# Altium project REX 9628 Extern Kernel 8.PrjPcb
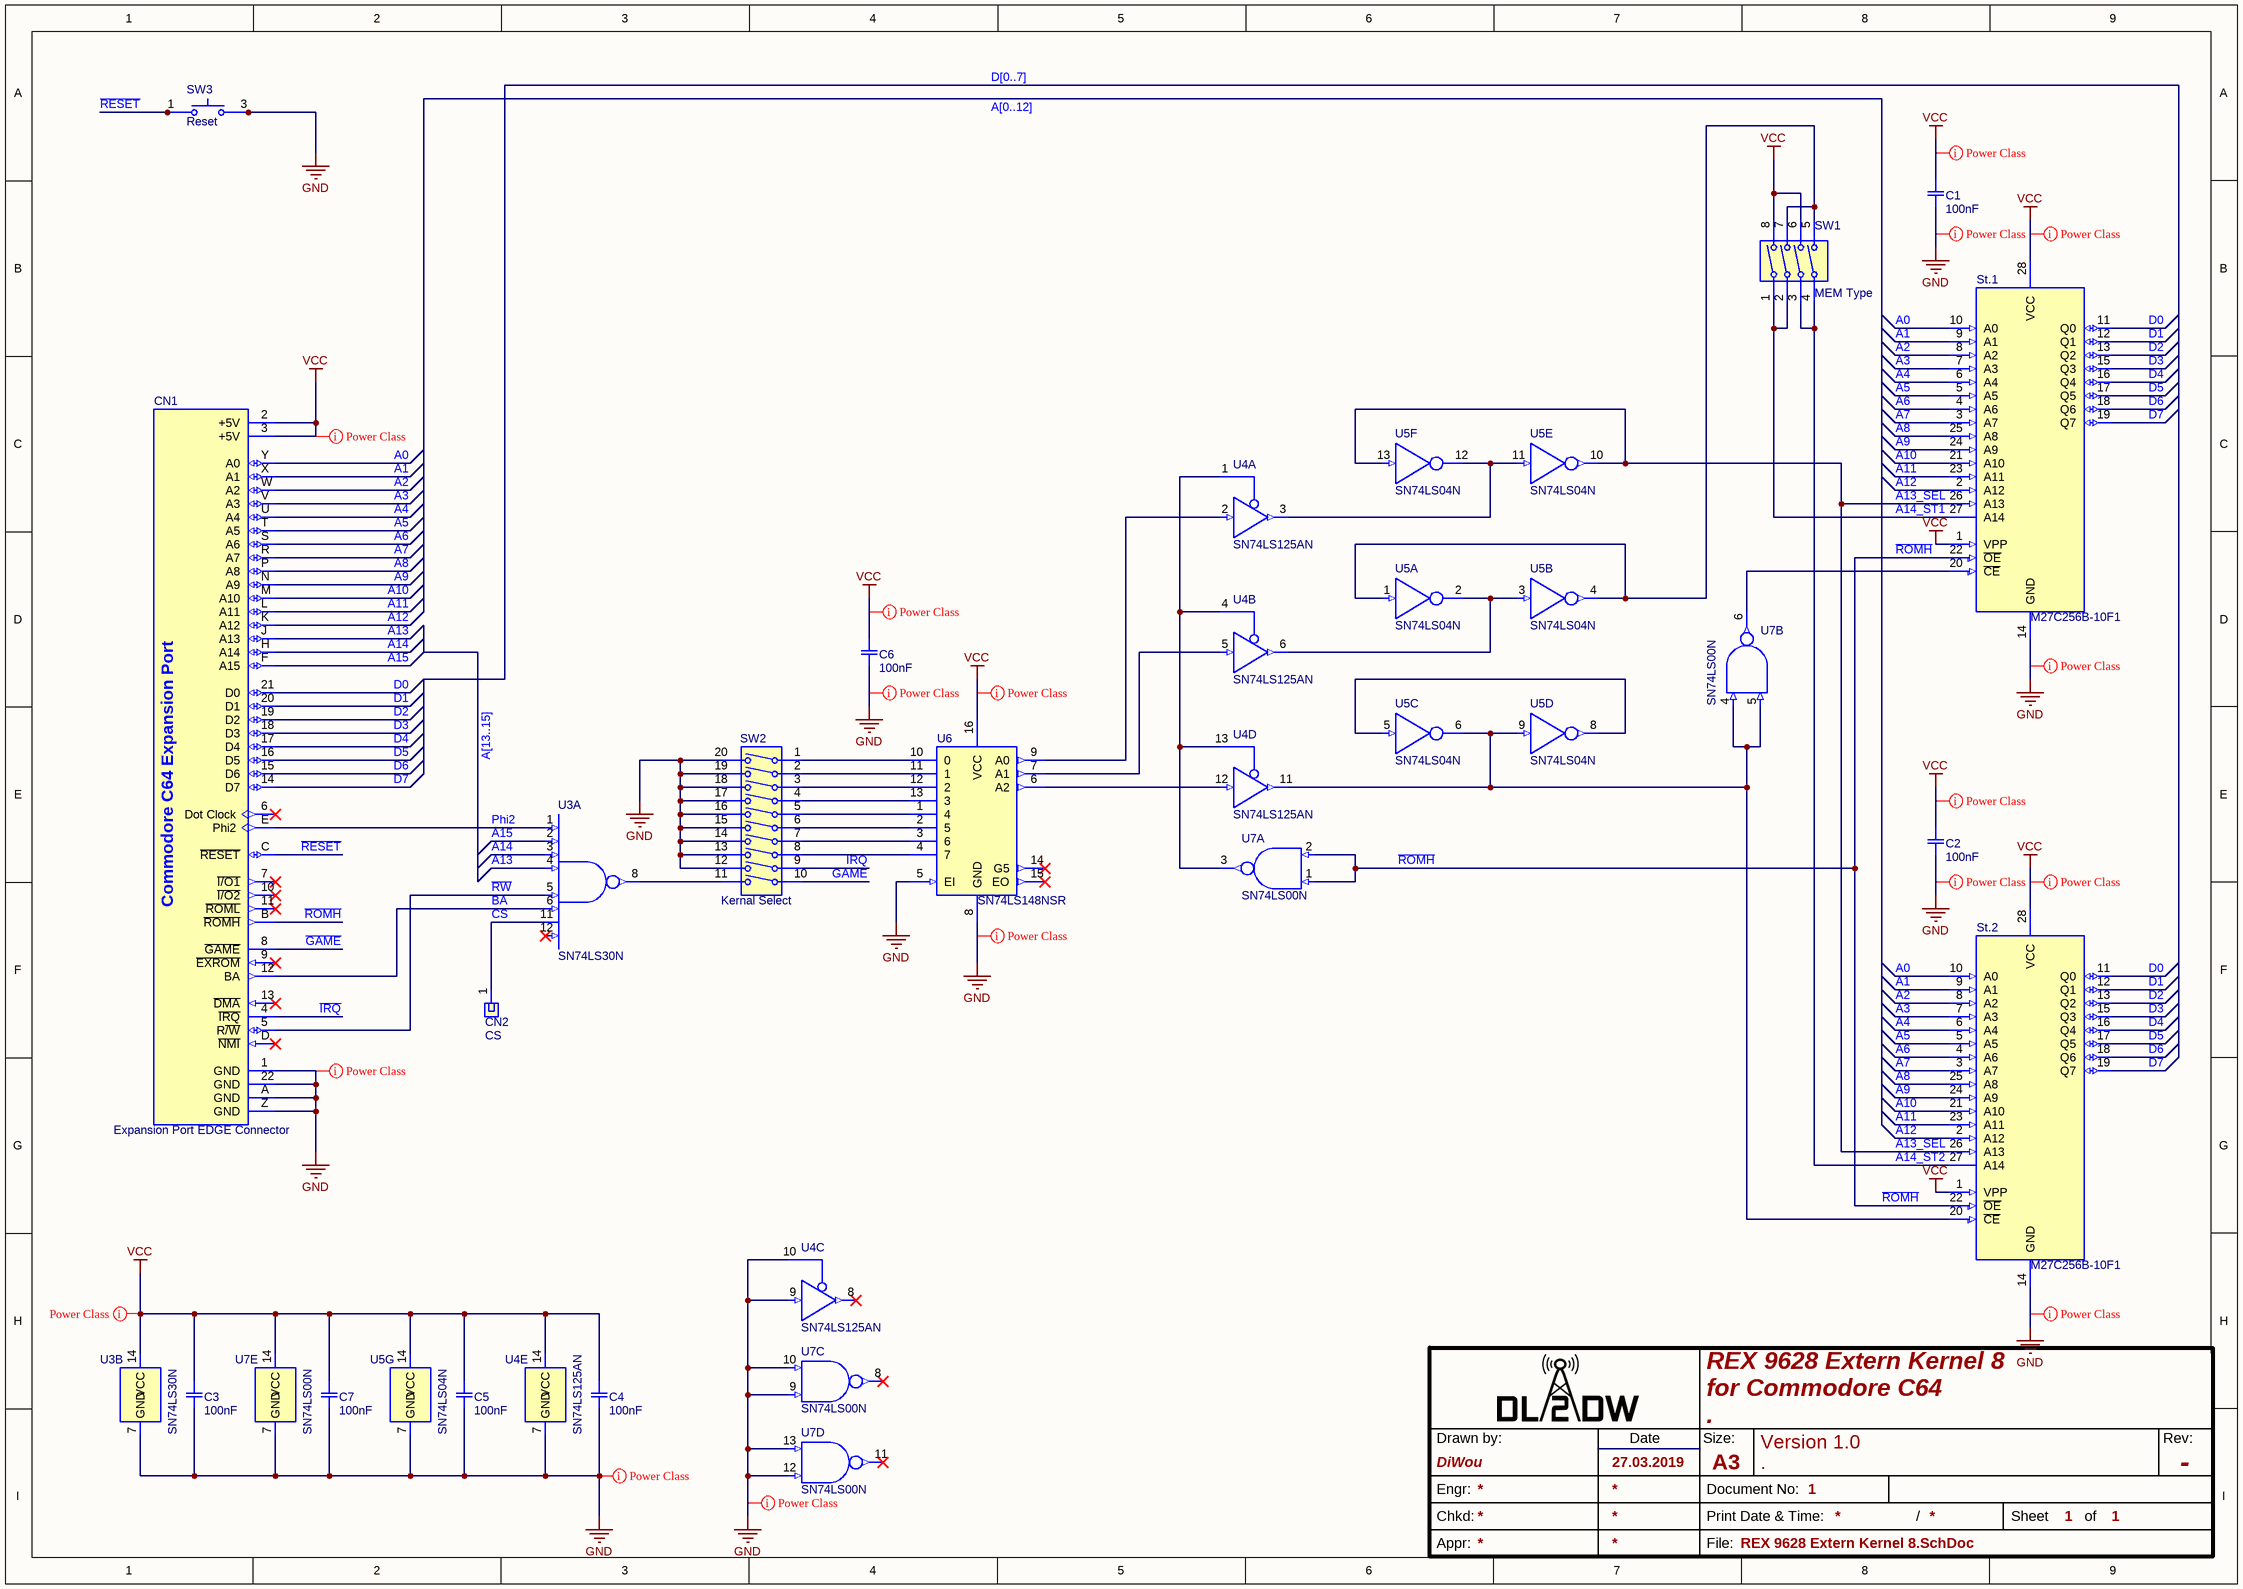
[diagram p0: REX 9628 Extern Kernel 8.SchDoc]
1 sheet, 19 parts. Net scope: global (net labels, ports and power ports of the same name join across sheets).
Board file: REX 9628 Extern Kernel 8.PcbDoc

## Sheet REX 9628 Extern Kernel 8.SchDoc: REX 9628 Extern Kernel 8
size 420 x 297 mm; CompanyName: DL2DW; DrawnBy: DiWou; Organization: DL2DW; DocumentNumber: 1; Revision: -; SheetNumber: 1; SheetTotal: 1; DrawnDate: 27.03.2019; Title1: REX 9628 Extern Kernel 8; Title2: for Commodore C64; Title3: .; Desc1: Version 1.0; Desc2: .

### Parts
C1  100nF  [CAP Disc 100nF P2.54mm D5.5mm T3mm]
C2  100nF  [CAP Disc 100nF P2.54mm D5.5mm T3mm]
C3  100nF  [CAP Disc 100nF P2.54mm D5.5mm T3mm]
C4  100nF  [CAP Disc 100nF P2.54mm D5.5mm T3mm]
C5  100nF  [CAP Disc 100nF P2.54mm D5.5mm T3mm]
C6  100nF  [CAP Disc 100nF P2.54mm D5.5mm T3mm]
C7  100nF  [CAP Disc 100nF P2.54mm D5.5mm T3mm]
CN1  Expansion Port EDGE Connector  [C64 Expansion Port EDGE Connector]  (no BOM)
CN2  CS  [Pin Header 01x01 2.54mm Horizontal Male]
St.1  M27C256B-10F1  [DIP-28 W15.24mm EPROM with Socket]
St.2  M27C256B-10F1  [DIP-28 W15.24mm EPROM with Socket]
SW1  MEM Type  [DIP Switch x04]
SW2  Kernal Select  [DIP Switch x10]
SW3  Reset  [Push Button 12x12mm H8.50mm THT]
U3  SN74LS30N  [SN74LS30N with Socket]  (parts A,B of 2)
U4  SN74LS125AN  [SN74LS125AN with Socket]  (parts A,B,C,D,E of 5)
U5  SN74LS04N  [SN74LS04N with Socket]  (parts A,B,C,D,E,F,G of 7)
U6  SN74LS148NSR  [SN74LS148N with Socket]
U7  SN74LS00N  [SN74LS00N]  (parts A,B,C,D,E of 5)

### Nets
GND: C1.2 C2.2 C3.2 C4.2 C5.2 C6.2 C7.2 CN1.1(GND) CN1.22(GND) CN1.A(GND) CN1.Z(GND) St.1.14(GND) St.2.14(GND) SW2.12 SW2.13 SW2.14 SW2.15 SW2.16 SW2.17 SW2.18 SW2.19 SW2.20 SW3.3 SW3.4 U3.7(GND) U4.7(GND) U4.9(3A) U4.10(~{3G}) U5.7(GND) U6.5(EI) U6.8(GND) U7.7(GND) U7.9(3B) U7.10(3A) U7.12(4B) U7.13(4A)
VCC: C1.1 C2.1 C3.1 C4.1 C5.1 C6.1 C7.1 CN1.2(+5V) CN1.3(+5V) St.1.1(VPP) St.1.28(VCC) St.2.1(VPP) St.2.28(VCC) SW1.6 SW1.8 U3.14(VCC) U4.14(VCC) U5.14(VCC) U6.16(VCC) U7.14(VCC)
~{GAME}: CN1.8(~{GAME}) SW2.10
~{IRQ}: CN1.4(~{IRQ}) SW2.9
~{RESET}: CN1.C(~{RESET}) SW3.1 SW3.2
~{ROMH}: CN1.B(~{ROMH}) St.1.22(~{OE}) St.2.22(~{OE}) U7.1(1A) U7.2(1B)
A0: CN1.Y(A0) St.1.10(A0) St.2.10(A0)
A1: CN1.X(A1) St.1.9(A1) St.2.9(A1)
A2: CN1.W(A2) St.1.8(A2) St.2.8(A2)
A3: CN1.V(A3) St.1.7(A3) St.2.7(A3)
A4: CN1.U(A4) St.1.6(A4) St.2.6(A4)
A5: CN1.T(A5) St.1.5(A5) St.2.5(A5)
A6: CN1.S(A6) St.1.4(A6) St.2.4(A6)
A7: CN1.R(A7) St.1.3(A7) St.2.3(A7)
A8: CN1.P(A8) St.1.25(A8) St.2.25(A8)
A9: CN1.N(A9) St.1.24(A9) St.2.24(A9)
A10: CN1.M(A10) St.1.21(A10) St.2.21(A10)
A11: CN1.L(A11) St.1.23(A11) St.2.23(A11)
A12: CN1.K(A12) St.1.2(A12) St.2.2(A12)
A13: CN1.J(A13) U3.4(D)
A13_SEL: St.1.26(A13) St.2.26(A13) U5.10(5Y) U5.13(6A)
A14: CN1.H(A14) U3.3(C)
A14_ST1: St.1.27(A14) SW1.1 SW1.2
A14_ST2: St.2.27(A14) SW1.3 SW1.4
A15: CN1.F(A15) U3.2(B)
BA: CN1.12(BA) U3.6(F)
CS: CN2.1 U3.11(F)
D0: CN1.21(D0) St.1.11(Q0) St.2.11(Q0)
D1: CN1.20(D1) St.1.12(Q1) St.2.12(Q1)
D2: CN1.19(D2) St.1.13(Q2) St.2.13(Q2)
D3: CN1.18(D3) St.1.15(Q3) St.2.15(Q3)
D4: CN1.17(D4) St.1.16(Q4) St.2.16(Q4)
D5: CN1.16(D5) St.1.17(Q5) St.2.17(Q5)
D6: CN1.15(D6) St.1.18(Q6) St.2.18(Q6)
D7: CN1.14(D7) St.1.19(Q7) St.2.19(Q7)
Phi2: CN1.E(Phi2) U3.1(A)
~{RW}: CN1.5(R~{/W}) U3.5(E)
NetSt.1_20: St.1.20(~{CE}) U7.6(2Y)
NetSt.2_20: St.2.20(~{CE}) U4.11(4Y) U5.6(3Y) U5.9(4A) U7.4(2A) U7.5(2B)
NetSW1_5: SW1.5 SW1.7 U5.1(1A) U5.4(2Y)
NetSW2_1: SW2.1 U6.10(0)
NetSW2_2: SW2.2 U6.11(1)
NetSW2_3: SW2.3 U6.12(2)
NetSW2_4: SW2.4 U6.13(3)
NetSW2_5: SW2.5 U6.1(4)
NetSW2_6: SW2.6 U6.2(5)
NetSW2_7: SW2.7 U6.3(6)
NetSW2_8: SW2.8 U6.4(7)
NetSW2_11: SW2.11 U3.8(1Y)
NetU4_1: U4.1(~{1G}) U4.4(~{2G}) U4.13(~{4G}) U7.3(1Y)
NetU4_2: U4.2(1A) U6.9(A0)
NetU4_3: U4.3(1Y) U5.11(5A) U5.12(6Y)
NetU4_5: U4.5(2A) U6.7(A1)
NetU4_6: U4.6(2Y) U5.2(1Y) U5.3(2A)
NetU4_12: U4.12(4A) U6.6(A2)
NetU5_5: U5.5(3A) U5.8(4Y)

Not connected (* = marked no-connect by the designer): CN1 6(Dot_Clock)* 7(~{I/O1})* 9(~{EXROM})* 10(~{I/O2})* 11(~{ROML})* 13(~{DMA})* D(~{NMI})*; U3 9(N/C) 10(N/C) 12(H)* 13(N/C); U4 8(3Y)*; U6 14(G5)* 15(EO)*; U7 8(3Y)* 11(4Y)*

### Buses and harness runs
bus A[0..12]
bus A[13..15]
bus D[0..7]

### Layout directives
net class Power: GND, VCC

### Notes on the sheet
- Drawn by:
- Date
- Size:
- A3
- Rev:
- Engr:
- Chkd:
- Appr:
- File:
- Document No:
- Print Date & Time:
- /
- Sheet
- of
- (in symbol CMP-Commodore-00008-4) Commodore C64 Expansion Port

### Library data of the parts
C1-C7 = CMP-Capacitors-Ceramic_Capacitors-00007-4: Ceramic Disc Capacitors 100nF -20%~+80% 50V Through Hole,P=2.54mm RoHS; ComponentLink1URL: https://lcsc.com/product-detail/Others_Dersonic-CC1H104ZA1PD3F5O3000_C353909.html
CN1 = CMP-Commodore-00008-4: Expansion Port EDGE Connector for Interface Cards
CN2 = CMP-Connectors-Male_PIN_Headers-00000-2: CONN HEADER .100 SNGL STR 1POS; Connector Type: Male Pin; Number of Positions: 1; Mount: Through Hole; Package Quantity: 1; Contact Mating Length: 0.318inch; Packaging: Bulk; Termination: Solder; Number of Rows: 1; Color: Black; Contact Plating: Gold
St.1 St.2 = CMP-ICs-Memory-00005-3: IC EPROM 256K PARALLEL 28CDIP; Nominal Supply Current: 50mA; Min Supply Voltage: 4.5V; Memory Type: EPROMs,EPROM; Max Supply Voltage: 5.5V; Density: 256Kb; Operating Supply Voltage: 5V; Frequency: 100GHz; Access Time: 100ns; Width: 13.36mm; Length: 37.34mm; Min Operating Temperature: 0°C; Lead Free: Lead Free; Package Quantity: 13; Max Operating Temperature: 70°C; Mount: Through Hole; Interface: Parallel; Number of Pins: 28; Height: 4.5mm; Packaging: Rail/Tube; Memory Size: 256Kb; Case/Package: DIP; Radiation Hardening: No; REACH SVHC: No SVHC
SW1 = CMP-Switches-0003-2: SWITCH SLIDE DIP SPST 25MA 24V; Mechanical Life: 5000Cycles; Electrical Life: 2000Cycles; Pitch: 0.1inch; Body Material: Nylon,Polyamide; Number of Positions: 4; Actuator Type: Slide (Standard); Washable: No; Lead Free: Lead Free; Packaging: Rail/Tube; Package Quantity: 47; Current Rating: 25mA; Min Operating Temperature: -40°C; Length: 0.439inch; Contact Plating: Gold; Mount: Through Hole; Termination: PC Pin; Max Operating Temperature: 85°C; Throw Configuration: SPST; Voltage Rating (DC): 24V
SW2 = CMP-Switches-0009-3: SWITCH SLIDE DIP SPST 25MA 24V; Number of Positions: 10; Electrical Life: 2000Cycles; Actuator Type: Slide (Standard); Body Material: Nylon,Polyamide; Pitch: 0.1inch; Washable: No; Mechanical Life: 5000Cycles; Packaging: Rail/Tube; Max Operating Temperature: 85°C; Contact Plating: Gold; Mount: Through Hole; Termination: PC Pin; Package Quantity: 20; Current Rating: 25mA; Voltage Rating (DC): 24V; Length: 1.039inch; Min Operating Temperature: -40°C; Throw Configuration: SPST
SW3 = CMP-Switches-0011-3: Black Button Tactile Switch, NO 50 mA 5mm Through Hole; Contact Current Rating: 50mA; Actuator Material: Polymer,Liquid Crystal Polymer; Throw Configuration: SPST; Operating Force: 160gf; Actuator Type: Standard; Switch Function: Off-Mom; Illumination Type: Non-Illuminated,Illuminated; Switch Travel: 0.3mm; Mechanical Life: 500000Cycles; Min Operating Temperature: -40°C; Max Operating Temperature: 85°C; Mount: Through Hole; Termination: PC Pin; Actuator Length: 5mm; Contact Material: Stainless Steel,Silver; Packaging: Bulk; REACH SVHC: No SVHC
U3 = CMP-ICs-74xx-series-00029-2: IC GATE NAND 1CH 8-INP 14DIP; High Level Output Current: -16mA; Low Level Output Current: 400uA; Propagation Delay: 20ns; Number of Elements: 1; Turn-On Delay Time: 22ns; Nominal Supply Current: 100uA; Number of Input Lines: 8; Output Current: 8mA; Max Supply Voltage: 5.25V; Operating Supply Voltage: 5V; Min Supply Voltage: 4.75V; Mount: Through Hole; Weight: 0.032734oz; Case/Package: PDIP; Packaging: Rail/Tube; Contact Plating: Gold; Radiation Hardening: No; Max Operating Temperature: 70°C; Number of Circuits: 1; Number of Gates: 1; Number of Outputs: 1; Logic Function: NAND; Number of Bits: 1; REACH SVHC: No SVHC; Termination: Through Hole; Min Operating Temperature: 0°C; Number of Inputs: 8; Lead Free: Lead Free; Number of Pins: 14; Package Quantity: 25; Max Output Current: 8mA; Number of Output Lines: 1
U4 = CMP-ICs-74xx-series-00054-1: IC BUS BUFF TRI-ST QD 14DIP; Quiescent Current: 11mA; Operating Supply Voltage: 5V; Schmitt Trigger Input: No; Propagation Delay: 18ns; Number of Elements: 4; Output Current: 24mA; Nominal Supply Current: 32mA; Max Output Current: 16mA; High Level Output Current: -2.6mA; Polarity: Non-Inverting; Max Supply Voltage: 5.25V; Logic Function: Buffer,Inverting; Number of Bits per Element: 1; Min Supply Voltage: 4.75V; Min Operating Temperature: 0°C; REACH SVHC: No SVHC; Contact Plating: Gold; Number of Output Lines: 4; Lead Free: Lead Free; Mount: Through Hole; Number of Input Lines: 4; Packaging: Rail/Tube; Number of Bits: 4; Number of Circuits: 4; Height: 4.57mm; Case/Package: PDIP; Number of Channels: 4; Turn-On Delay Time: 18ns; Termination: Through Hole; Low Level Output Current: 24mA; Max Operating Temperature: 70°C; Number of Pins: 14; Width: 6.35mm; Package Quantity: 25; Number of Outputs: 4; Length: 19.3mm; Number of Inputs: 4
U5 = CMP-ICs-74xx-series-00006-2: IC HEX INVERTER 14-DIP; Low Level Output Current: 8mA; Number of Output Lines: 6; Propagation Delay: 15ns; High Level Output Current: -400uA; Operating Supply Voltage: 5V; Min Supply Voltage: 4.75V; Logic Function: Buffer,Inverter; Turn-On Delay Time: 22ns; Nominal Supply Current: 100uA; Number of Inputs: 1; Max Supply Voltage: 5.25V; Schmitt Trigger Input: No; Contact Plating: Gold; Packaging: Rail/Tube; Case/Package: PDIP; Lead Free: Lead Free; Weight: 0.032734oz; Width: 6.35mm; Number of Pins: 14; Output Current: 8mA; Number of Gates: 6; Length: 19.3mm; REACH SVHC: No SVHC; Max Output Current: 8mA; Number of Circuits: 6; Min Operating Temperature: 0°C; Number of Bits: 6; Mount: Through Hole; Height: 4.57mm; Package Quantity: 25; Number of Elements: 6; Max Operating Temperature: 70°C; Radiation Hardening: No; Termination: Through Hole
U6 = CMP-ICs-74xx-series-00053-2: IC PRIORITY ENCODER 8-3L 16SO; Propagation Delay: 13ns; Number of Channels: 1; Number of Bits: 8; Supply Type: Single; Operating Supply Voltage: 5V; Logic Function: Multiplexer; Number of Outputs: 3; Turn-On Delay Time: 55ns; Min Supply Voltage: 4.75V; Max Supply Voltage: 5.25V; Bandwidth: 35MHz; Max Operating Temperature: 70°C; Weight: 0.007079oz; Mount: Surface Mount; Independent Circuits: 1; Radiation Hardening: No; Lead Free: Lead Free; Packaging: Tape and Reel; Number of Pins: 16; Min Operating Temperature: 0°C; Package Quantity: 2000; Case/Package: SOP; Number of Input Lines: 8; Number of Inputs: 8; Number of Output Lines: 3
U7 = CMP-ICs-74xx-series-00000-3: IC, 74LS, 74LS00, DIP14, 5.25V; Number of Gates: 4; High Level Output Current: -400uA; Number of Input Lines: 2; Number of Output Lines: 1; Low Level Output Current: 8mA; Schmitt Trigger Input: No; Min Supply Voltage: 4.75V; Turn-On Delay Time: 15ns; Output Current: 16mA; Logic Function: NAND; Operating Supply Voltage: 5V; Quiescent Current: 2.4mA; Max Operating Temperature: 70°C; Number of Bits: 4; Packaging: Rail/Tube; Case/Package: PDIP; Lead Free: Lead Free; Length: 19.3mm; Radiation Hardening: No; Package Quantity: 25; Width: 6.35mm; Number of Elements: 4; Mount: Through Hole; Number of Circuits: 4; Min Operating Temperature: 0°C; Contact Plating: Gold; Number of Outputs: 1; Height: 4.57mm; Number of Inputs: 2; Number of Pins: 14; Propagation Delay: 15ns; REACH SVHC: No SVHC; Max Supply Voltage: 5.25V; Weight: 0.032734oz